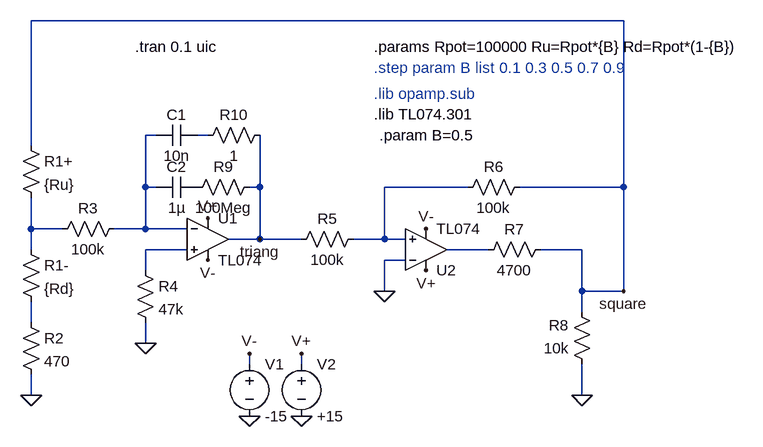
[diagram p0: schematic LFO_schematic.asc]
LFO_schematic.asc, the LTspice schematic file:
Version 4
SHEET 1 1124 680
WIRE 928 32 16 32
WIRE 208 208 192 208
WIRE 288 208 272 208
WIRE 16 224 16 32
WIRE 192 288 192 208
WIRE 208 288 192 288
WIRE 368 288 368 208
WIRE 368 288 352 288
WIRE 688 288 560 288
WIRE 928 288 928 32
WIRE 928 288 768 288
WIRE 16 352 16 304
WIRE 64 352 16 352
WIRE 192 352 192 288
WIRE 192 352 144 352
WIRE 256 352 192 352
WIRE 368 368 368 288
WIRE 368 368 320 368
WIRE 432 368 368 368
WIRE 560 368 560 288
WIRE 560 368 512 368
WIRE 592 368 560 368
WIRE 16 384 16 352
WIRE 256 384 192 384
WIRE 720 384 656 384
WIRE 864 384 800 384
WIRE 592 400 560 400
WIRE 192 416 192 384
WIRE 560 448 560 400
WIRE 864 448 864 384
WIRE 928 448 928 288
WIRE 928 448 864 448
WIRE 864 480 864 448
WIRE 16 496 16 464
WIRE 192 528 192 496
WIRE 352 560 352 544
WIRE 432 560 432 544
WIRE 16 608 16 576
WIRE 864 608 864 560
FLAG 16 608 0
FLAG 192 528 0
FLAG 560 448 0
FLAG 864 608 0
FLAG 368 368 triang
FLAG 928 448 square
FLAG 352 544 V-
FLAG 432 544 V+
FLAG 352 640 0
FLAG 432 640 0
FLAG 288 400 V-
FLAG 624 352 V-
FLAG 288 336 V+
FLAG 624 416 V+
SYMBOL res 0 368 R0
SYMATTR InstName R1-
SYMATTR Value {Rd}
SYMBOL res 0 480 R0
SYMATTR InstName R2
SYMATTR Value 470
SYMBOL res 0 208 R0
SYMATTR InstName R1+
SYMATTR Value {Ru}
SYMBOL res 160 336 R90
WINDOW 0 0 56 VBottom 2
WINDOW 3 32 56 VTop 2
SYMATTR InstName R3
SYMATTR Value 100k
SYMBOL res 176 400 R0
SYMATTR InstName R4
SYMATTR Value 47k
SYMBOL res 528 352 R90
WINDOW 0 0 56 VBottom 2
WINDOW 3 32 56 VTop 2
SYMATTR InstName R5
SYMATTR Value 100k
SYMBOL res 784 272 R90
WINDOW 0 0 56 VBottom 2
WINDOW 3 32 56 VTop 2
SYMATTR InstName R6
SYMATTR Value 100k
SYMBOL res 816 368 R90
WINDOW 0 0 56 VBottom 2
WINDOW 3 32 56 VTop 2
SYMATTR InstName R7
SYMATTR Value 4700
SYMBOL res 880 576 R180
WINDOW 0 36 76 Left 2
WINDOW 3 36 40 Left 2
SYMATTR InstName R8
SYMATTR Value 10k
SYMBOL res 384 192 R90
WINDOW 0 0 56 VBottom 2
WINDOW 3 32 56 VTop 2
SYMATTR InstName R10
SYMATTR Value 1
SYMBOL res 368 272 R90
WINDOW 0 0 56 VBottom 2
WINDOW 3 32 56 VTop 2
SYMATTR InstName R9
SYMATTR Value 100Meg
SYMBOL cap 272 192 R90
WINDOW 0 0 32 VBottom 2
WINDOW 3 32 32 VTop 2
SYMATTR InstName C1
SYMATTR Value 10n
SYMBOL cap 272 272 R90
WINDOW 0 0 32 VBottom 2
WINDOW 3 32 32 VTop 2
SYMATTR InstName C2
SYMATTR Value 1µ
SYMBOL opamp2 288 304 R0
SYMATTR InstName U1
SYMATTR Value TL074
SYMBOL opamp2 624 448 M180
SYMATTR InstName U2
SYMATTR Value TL074
SYMBOL voltage 352 544 R0
SYMATTR InstName V1
SYMATTR Value -15
SYMBOL voltage 432 544 R0
SYMATTR InstName V2
SYMATTR Value +15
TEXT 544 72 Left 2 !.params Rpot=100000 Ru=Rpot*{B} Rd=Rpot*(1-{B})
TEXT 544 104 Left 2 ;.step param B list 0.1 0.3 0.5 0.7 0.9
TEXT 544 144 Left 2 ;.lib opamp.sub
TEXT 176 72 Left 2 !.tran 0.1 uic
TEXT 544 176 Left 2 !.lib TL074.301
TEXT 552 208 Left 2 !.param B=0.5

The netlist it stands for:
* LFO_schematic.asc
R1- N004 N007 {Rd}
R2 N007 0 470
R1+ square N004 {Ru}
R3 N001 N004 100k
R4 N005 0 47k
R5 N003 triang 100k
R6 square N003 100k
R7 square N006 4700
R8 0 square 10k
R10 triang N002 1
R9 triang P001 100Meg
C1 N002 N001 10n
C2 P001 N001 1µ
XU1 N005 N001 V+ V- triang TL074  ; pins In+ In- V+ V- OUT
XU2 N003 0 V+ V- N006 TL074  ; pins In+ In- V+ V- OUT
V1 V- 0 -15
V2 V+ 0 +15
.params Rpot=100000 Ru=Rpot*{B} Rd=Rpot*(1-{B})
* .step param B list 0.1 0.3 0.5 0.7 0.9
* .lib opamp.sub
.tran 0.1 uic
.lib TL074.301
.param B=0.5
.backanno
.end

* Results of the author's LTspice run, read from the files saved beside the schematic
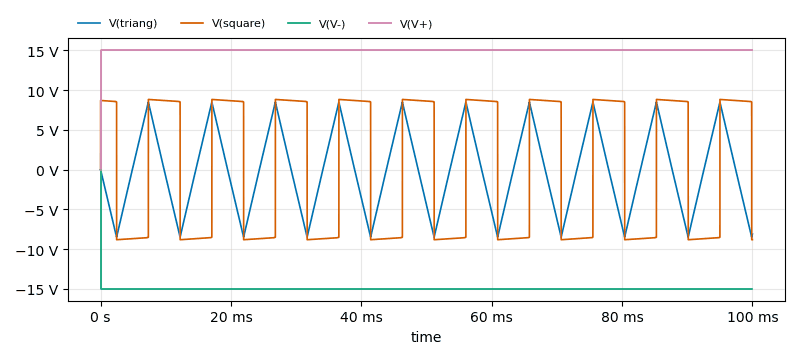
[diagram p1: Transient Analysis of LFO_schematic.asc, plotted from the saved traces]
* Transient Analysis, 1 run:
*   V(triang): min -8.501 V, max 8.501 V, average -113.9 mV, rms 5.754 V, last -8.108 V
*   V(square): min -8.825 V, max 8.824 V, average 202.3 mV, rms 8.691 V, last -8.82 V
*   V(V-): min -15 V, max 0 V, average -15 V, rms 15 V, last -15 V
*   V(V+): min 0 V, max 15 V, average 15 V, rms 15 V, last 15 V